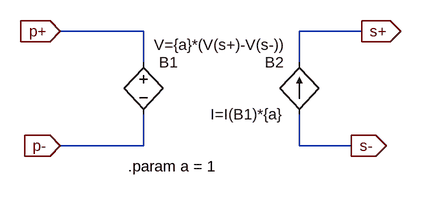
[diagram p0: schematic trafo_ideal.asc]
trafo_ideal.asc, the LTspice schematic file:
Version 4
SHEET 1 880 680
WIRE -16 80 -144 80
WIRE 320 80 224 80
WIRE -16 128 -16 80
WIRE 224 128 224 80
WIRE -16 256 -16 208
WIRE -16 256 -144 256
WIRE 224 256 224 208
WIRE 304 256 224 256
FLAG 320 80 s+
IOPIN 320 80 Out
FLAG 304 256 s-
IOPIN 304 256 Out
FLAG -144 80 p+
IOPIN -144 80 In
FLAG -144 256 p-
IOPIN -144 256 In
SYMBOL bi 224 208 R180
WINDOW 0 24 80 Left 2
WINDOW 3 24 0 Left 2
SYMATTR InstName B2
SYMATTR Value I=I(B1)*{a}
SYMBOL bv -16 112 R0
WINDOW 3 16 -11 Left 2
SYMATTR Value V={a}*(V(s+)-V(s-))
SYMATTR InstName B1
TEXT -40 288 Left 2 !.param a = 1

The netlist it stands for:
* trafo_ideal.asc
B2 s- s+ I=I(B1)*{a}
B1 p+ p- V={a}*(V(s+)-V(s-))
.param a = 1
.backanno
.end